# Altium project UWB_DWM1000.PrjPcb
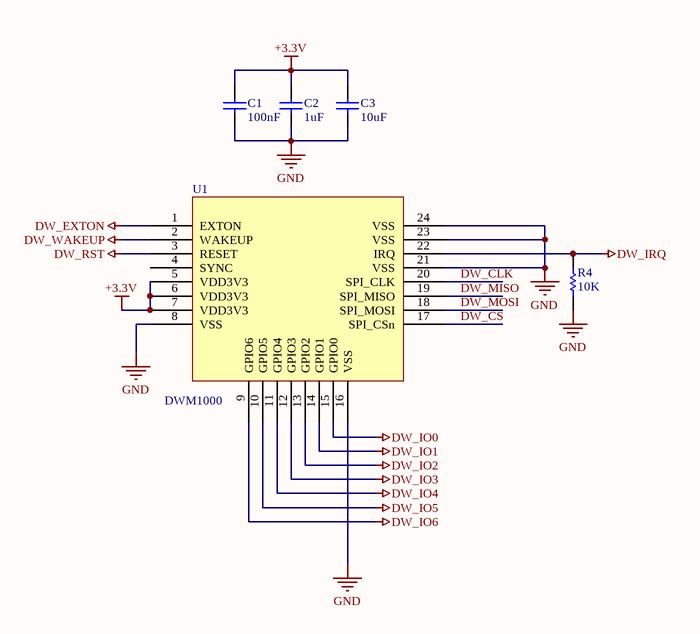
[diagram p0: UWB_DWM1000.SchDoc]
2 sheets, 21 parts. Net scope: global (net labels, ports and power ports of the same name join across sheets).
Board files: UWB_DWM1000_ParaChina.PcbDoc, UWB_DWM1000.PcbDoc
Sheets:
  UWB_DWM1000.SchDoc
  UWB_STM32F411.SchDoc

## Sheet UWB_DWM1000.SchDoc
size A4

### Parts
C1  value 100nF  [CAPC1608N]  (hidden comment: Cap)
C2  value 1uF  [CAPC1608N]  (hidden comment: Cap)
C3  value 10uF  [CAPC1608N]  (hidden comment: Cap)
R4  value 10K  [RESC1608N]  (hidden comment: Res1)
U1  DWM1000  [DWM1000]

### Nets
+3.3V: C1.1 C2.1 C3.1 U1.5(VDD3V3) U1.6(VDD3V3) U1.7(VDD3V3)
DW_CLK: U1.20(SPI_CLK)
DW_CS: U1.17(SPI_CSn)
DW_EXTON: U1.1(EXTON)
DW_IO0: U1.15(GPIO0)
DW_IO1: U1.14(GPIO1)
DW_IO2: U1.13(GPIO2)
DW_IO3: U1.12(GPIO3)
DW_IO4: U1.11(GPIO4)
DW_IO5: U1.10(GPIO5)
DW_IO6: U1.9(GPIO6)
DW_IRQ: R4.2 U1.22(IRQ)
DW_MISO: U1.19(SPI_MISO)
DW_MOSI: U1.18(SPI_MOSI)
DW_RST: U1.3(RESET)
DW_WAKEUP: U1.2(WAKEUP)
GND: C1.2 C2.2 C3.2 R4.1 U1.8(VSS) U1.16(VSS) U1.21(VSS) U1.23(VSS) U1.24(VSS)  [project net AGND]

Not connected (* = marked no-connect by the designer): U1 4(SYNC)

### Library data of the parts
C1-C3 = Cap: Capacitor; Published: 8-Jun-2000; LatestRevisionDate: 17-Jul-2002; LatestRevisionNote: Re-released for DXP Platform.; PackageReference: RAD-0.3; Publisher: Altium Limited
R4 = Res1: Resistor; Published: 8-Jun-2000; LatestRevisionDate: 17-Jul-2002; LatestRevisionNote: Re-released for DXP Platform.; PackageReference: AXIAL-0.3; Publisher: Altium Limited
U1 = DWM1000: MOD IEEE802.15.4-2011 UWB TXRX; Manufacturer: Decawave Limited; Frequency: 3.5GHz ~ 6.5GHz; Data Rate: 6.8Mbps; Serial Interfaces: SPI; Antenna Type: Integrated, Chip; Voltage - Supply: 2.8 V ~ 3.6 V; Current - Receiving: 64mA; Current - Transmitting: 31mA; Supplier 1: Digi-Key; Manufacturer Part Number: DWM1000; RoHS: RoHS Compliant; Category: RF/IF and RFID; Stock 1: 1028; Pricing 1: 1=32.16, 10=26.704, 100=24.24, 250=22.51296 (USD); Packaging: Cut Tape (CT); RF Family/Standard: 802.15.4; Protocol: -; Modulation: -; Power - Output: -; Sensitivity: -; Memory Size: -; Mounting Type: Surface Mount; Operating Temperature: -40°C ~ 85°C; Package / Case: Module; ComponentLink1URL: http://www.decawave.com/sites/default/files/product-pdf/dwm1000-product-brief.pdf; ComponentLink1Description: http://www.decawave.com/sites/default/files/product-pdf/dwm1000-product-brief.pdf; Supplier Part Number 1: 1479-1002-1-ND

## Sheet UWB_STM32F411.SchDoc
size A4
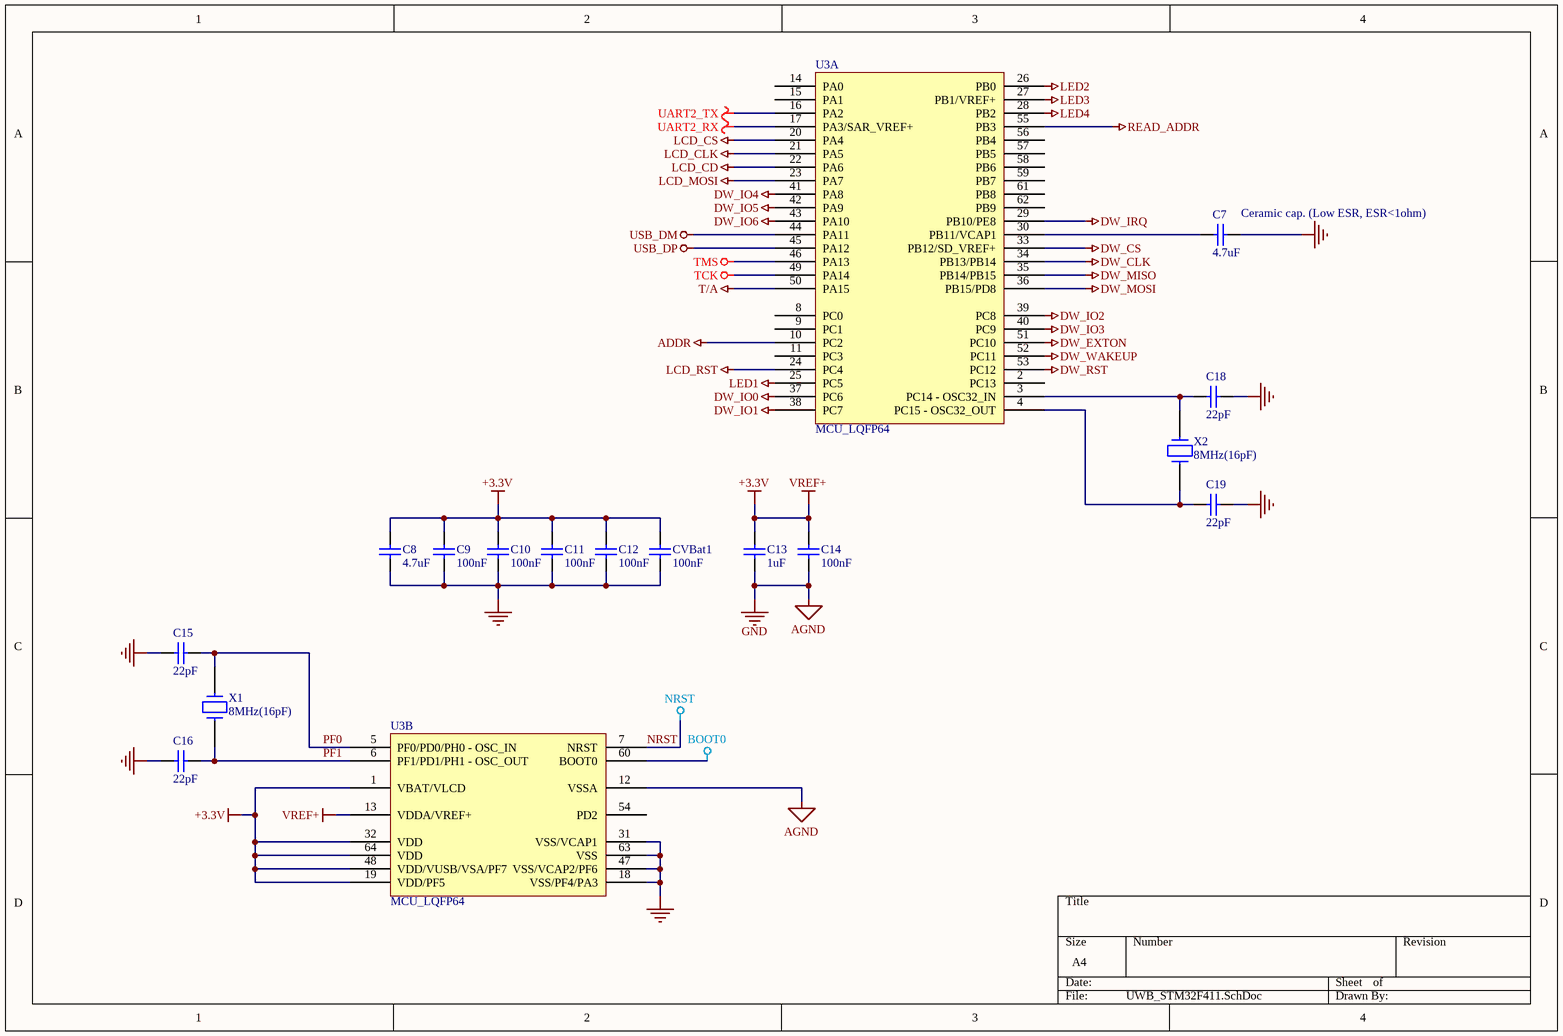
[diagram p1: UWB_STM32F411.SchDoc]

### Parts
C7  value 4.7uF  [CAPC2012L]  (hidden comment: Cap)
C8  value 4.7uF  [CAPC2012L]  (hidden comment: Cap)
C9  value 100nF  [CAPC1608L]  (hidden comment: Cap)
C10  value 100nF  [CAPC1608L]  (hidden comment: Cap)
C11  value 100nF  [CAPC1608L]  (hidden comment: Cap)
C12  value 100nF  [CAPC1608L]  (hidden comment: Cap)
C13  value 1uF  [CAPC1608L]  (hidden comment: Cap)
C14  value 100nF  [CAPC1608L]  (hidden comment: Cap)
C15  value 22pF  [CAPC1608L]  (hidden comment: Cap)
C16  value 22pF  [CAPC1608L]  (hidden comment: Cap)
C18  value 22pF  [CAPC1608L]  (hidden comment: Cap)
C19  value 22pF  [CAPC1608L]  (hidden comment: Cap)
CVBat1  value 100nF  [CAPC1608L]  (hidden comment: Cap)
U3  MCU_LQFP64  [LQFP64]  (parts A,B of 2)
X1  8MHz(16pF)  [XTAL ABM7]
X2  8MHz(16pF)  [XTAL ABS13]

### Nets
+3.3V: C8.2 C9.2 C10.2 C11.2 C12.2 C13.2 C14.2 CVBat1.2 U3.1(VBAT/VLCD) U3.13(VDDA/VREF+) U3.19(VDD/PF5) U3.32(VDD) U3.48(VDD/VUSB/VSA/PF7) U3.64(VDD)  [also labelled VREF+]
ADDR: U3.10(PC2)
AGND: C7.1 C8.1 C9.1 C10.1 C11.1 C12.1 C13.1 C14.1 C15.2 C16.2 C18.2 C19.2 CVBat1.1 U3.12(VSSA) U3.18(VSS/PF4/PA3) U3.31(VSS/VCAP1) U3.47(VSS/VCAP2/PF6) U3.63(VSS)  [also labelled GND]
BOOT0: U3.60(BOOT0)
DW_CLK: U3.34(PB13/PB14)
DW_CS: U3.33(PB12/SD_VREF+)
DW_EXTON: U3.51(PC10)
DW_IO0: U3.37(PC6)
DW_IO1: U3.38(PC7)
DW_IO2: U3.39(PC8)
DW_IO3: U3.40(PC9)
DW_IO4: U3.41(PA8)
DW_IO5: U3.42(PA9)
DW_IO6: U3.43(PA10)
DW_IRQ: U3.29(PB10/PE8)
DW_MISO: U3.35(PB14/PB15)
DW_MOSI: U3.36(PB15/PD8)
DW_RST: U3.53(PC12)
DW_WAKEUP: U3.52(PC11)
LCD_CD: U3.22(PA6)
LCD_CLK: U3.21(PA5)
LCD_CS: U3.20(PA4)
LCD_MOSI: U3.23(PA7)
LCD_RST: U3.24(PC4)
LED1: U3.25(PC5)
LED2: U3.26(PB0)
LED3: U3.27(PB1/VREF+)
LED4: U3.28(PB2)
NRST: U3.7(NRST)
READ_ADDR: U3.55(PB3)
T/A: U3.50(PA15)
TCK: U3.49(PA14)
TMS: U3.46(PA13)
UART2_RX: U3.17(PA3/SAR_VREF+)
UART2_TX: U3.16(PA2)
USB_DM: U3.44(PA11)
USB_DP: U3.45(PA12)
PF0: C15.1 U3.5(PF0/PD0/PH0_-_OSC_IN) X1.2
PF1: C16.1 U3.6(PF1/PD1/PH1_-_OSC_OUT) X1.1
NetC7_2: C7.2 U3.30(PB11/VCAP1)
NetC18_1: C18.1 U3.3(PC14_-_OSC32_IN) X2.1
NetC19_1: C19.1 U3.4(PC15_-_OSC32_OUT) X2.2

Not connected (* = marked no-connect by the designer): U3 2(PC13) 8(PC0) 9(PC1) 11(PC3) 14(PA0) 15(PA1) 54(PD2) 56(PB4) 57(PB5) 58(PB6) 59(PB7) 61(PB8) 62(PB9)

### Notes on the sheet
- (near C7) Ceramic cap. (Low ESR, ESR<1ohm)
- Labels drawn without touching a wire or pin: GND

### Library data of the parts
C7 C8 = Cap: Capacitor; Proveedor: Future Electronics; PN: CC0805KRX5R6BB475; Proveedor 2: Elemon; PN 2: CA3279960; Published: 8-Jun-2000; LatestRevisionDate: 17-Jul-2002; LatestRevisionNote: Re-released for DXP Platform.; PackageReference: RAD-0.3; Publisher: Altium Limited; PackageDescription: Radial Cap, Thru-Hole; 2 Leads; 0.3 in Pin Spacing
C9-C12 C14 CVBat1 = Cap: Capacitor; Proveedor: Future Electronics; PN: CC0603KRX7R6BB104; Proveedor 2: Elemon; PN 2: CA3289100; Published: 8-Jun-2000; LatestRevisionDate: 17-Jul-2002; LatestRevisionNote: Re-released for DXP Platform.; PackageReference: RAD-0.3; Publisher: Altium Limited; PackageDescription: Radial Cap, Thru-Hole; 2 Leads; 0.3 in Pin Spacing
C13 = Cap: Capacitor; Proveedor: Future Electronics; PN: CC0603KRX5R5BB105; Proveedor 2: Elemon; PN 2: CA3289821; Published: 8-Jun-2000; LatestRevisionDate: 17-Jul-2002; LatestRevisionNote: Re-released for DXP Platform.; PackageReference: RAD-0.3; Publisher: Altium Limited; PackageDescription: Radial Cap, Thru-Hole; 2 Leads; 0.3 in Pin Spacing
C15 C16 C18 C19 = Cap: Capacitor; Proveedor: Future Electronics; PN: 0603YA220KAT2A; Proveedor 2: Elemon; PN 2: CA3288483; Published: 8-Jun-2000; LatestRevisionDate: 17-Jul-2002; LatestRevisionNote: Re-released for DXP Platform.; PackageReference: RAD-0.3; Publisher: Altium Limited; PackageDescription: Radial Cap, Thru-Hole; 2 Leads; 0.3 in Pin Spacing
U3 = MCU_LQFP64: PN 2: STM32F411RE
X1 X2 = CRYSTAL: PN: ABM7-8.000MHZ-D2Y-T; Proveedor: Future Electronics; PN 2: X1; Value: 8MHz(16pF)

## Nets that join several sheets
+3.3V: UWB_DWM1000 (6 pins), UWB_STM32F411 (14 pins)
AGND: UWB_DWM1000 (9 pins), UWB_STM32F411 (18 pins)
DW_CLK: UWB_DWM1000 (U1.20), UWB_STM32F411 (U3.34)
DW_CS: UWB_DWM1000 (U1.17), UWB_STM32F411 (U3.33)
DW_EXTON: UWB_DWM1000 (U1.1), UWB_STM32F411 (U3.51)
DW_IO0: UWB_DWM1000 (U1.15), UWB_STM32F411 (U3.37)
DW_IO1: UWB_DWM1000 (U1.14), UWB_STM32F411 (U3.38)
DW_IO2: UWB_DWM1000 (U1.13), UWB_STM32F411 (U3.39)
DW_IO3: UWB_DWM1000 (U1.12), UWB_STM32F411 (U3.40)
DW_IO4: UWB_DWM1000 (U1.11), UWB_STM32F411 (U3.41)
DW_IO5: UWB_DWM1000 (U1.10), UWB_STM32F411 (U3.42)
DW_IO6: UWB_DWM1000 (U1.9), UWB_STM32F411 (U3.43)
DW_IRQ: UWB_DWM1000 (R4.2 U1.22), UWB_STM32F411 (U3.29)
DW_MISO: UWB_DWM1000 (U1.19), UWB_STM32F411 (U3.35)
DW_MOSI: UWB_DWM1000 (U1.18), UWB_STM32F411 (U3.36)
DW_RST: UWB_DWM1000 (U1.3), UWB_STM32F411 (U3.53)
DW_WAKEUP: UWB_DWM1000 (U1.2), UWB_STM32F411 (U3.52)